# Altium schematic sheet dast.SchDoc
size A3; SPICEModelCacheRLVYLVLF: <root> / <DocumentId>RLVYLVLF</DocumentId> / <CacheFrame Number="0"> / <Model Name="qnpn" Kind="MDL"> / <Text>*QNPN / *NPN Trans Pinout: C,B,E / .MODEL QNPN NPN(IS=3.2E-16 BF=141 VAF=35 ISE=2.6 NE=1.46 CJE=1E-13 / + MJE=0.333 TF=6E-11 CJC=1E-13 CJS=2.2E-13 MJS=0.5 FC=0.67 )</Text> / </Model> / </CacheFrame> / </root>
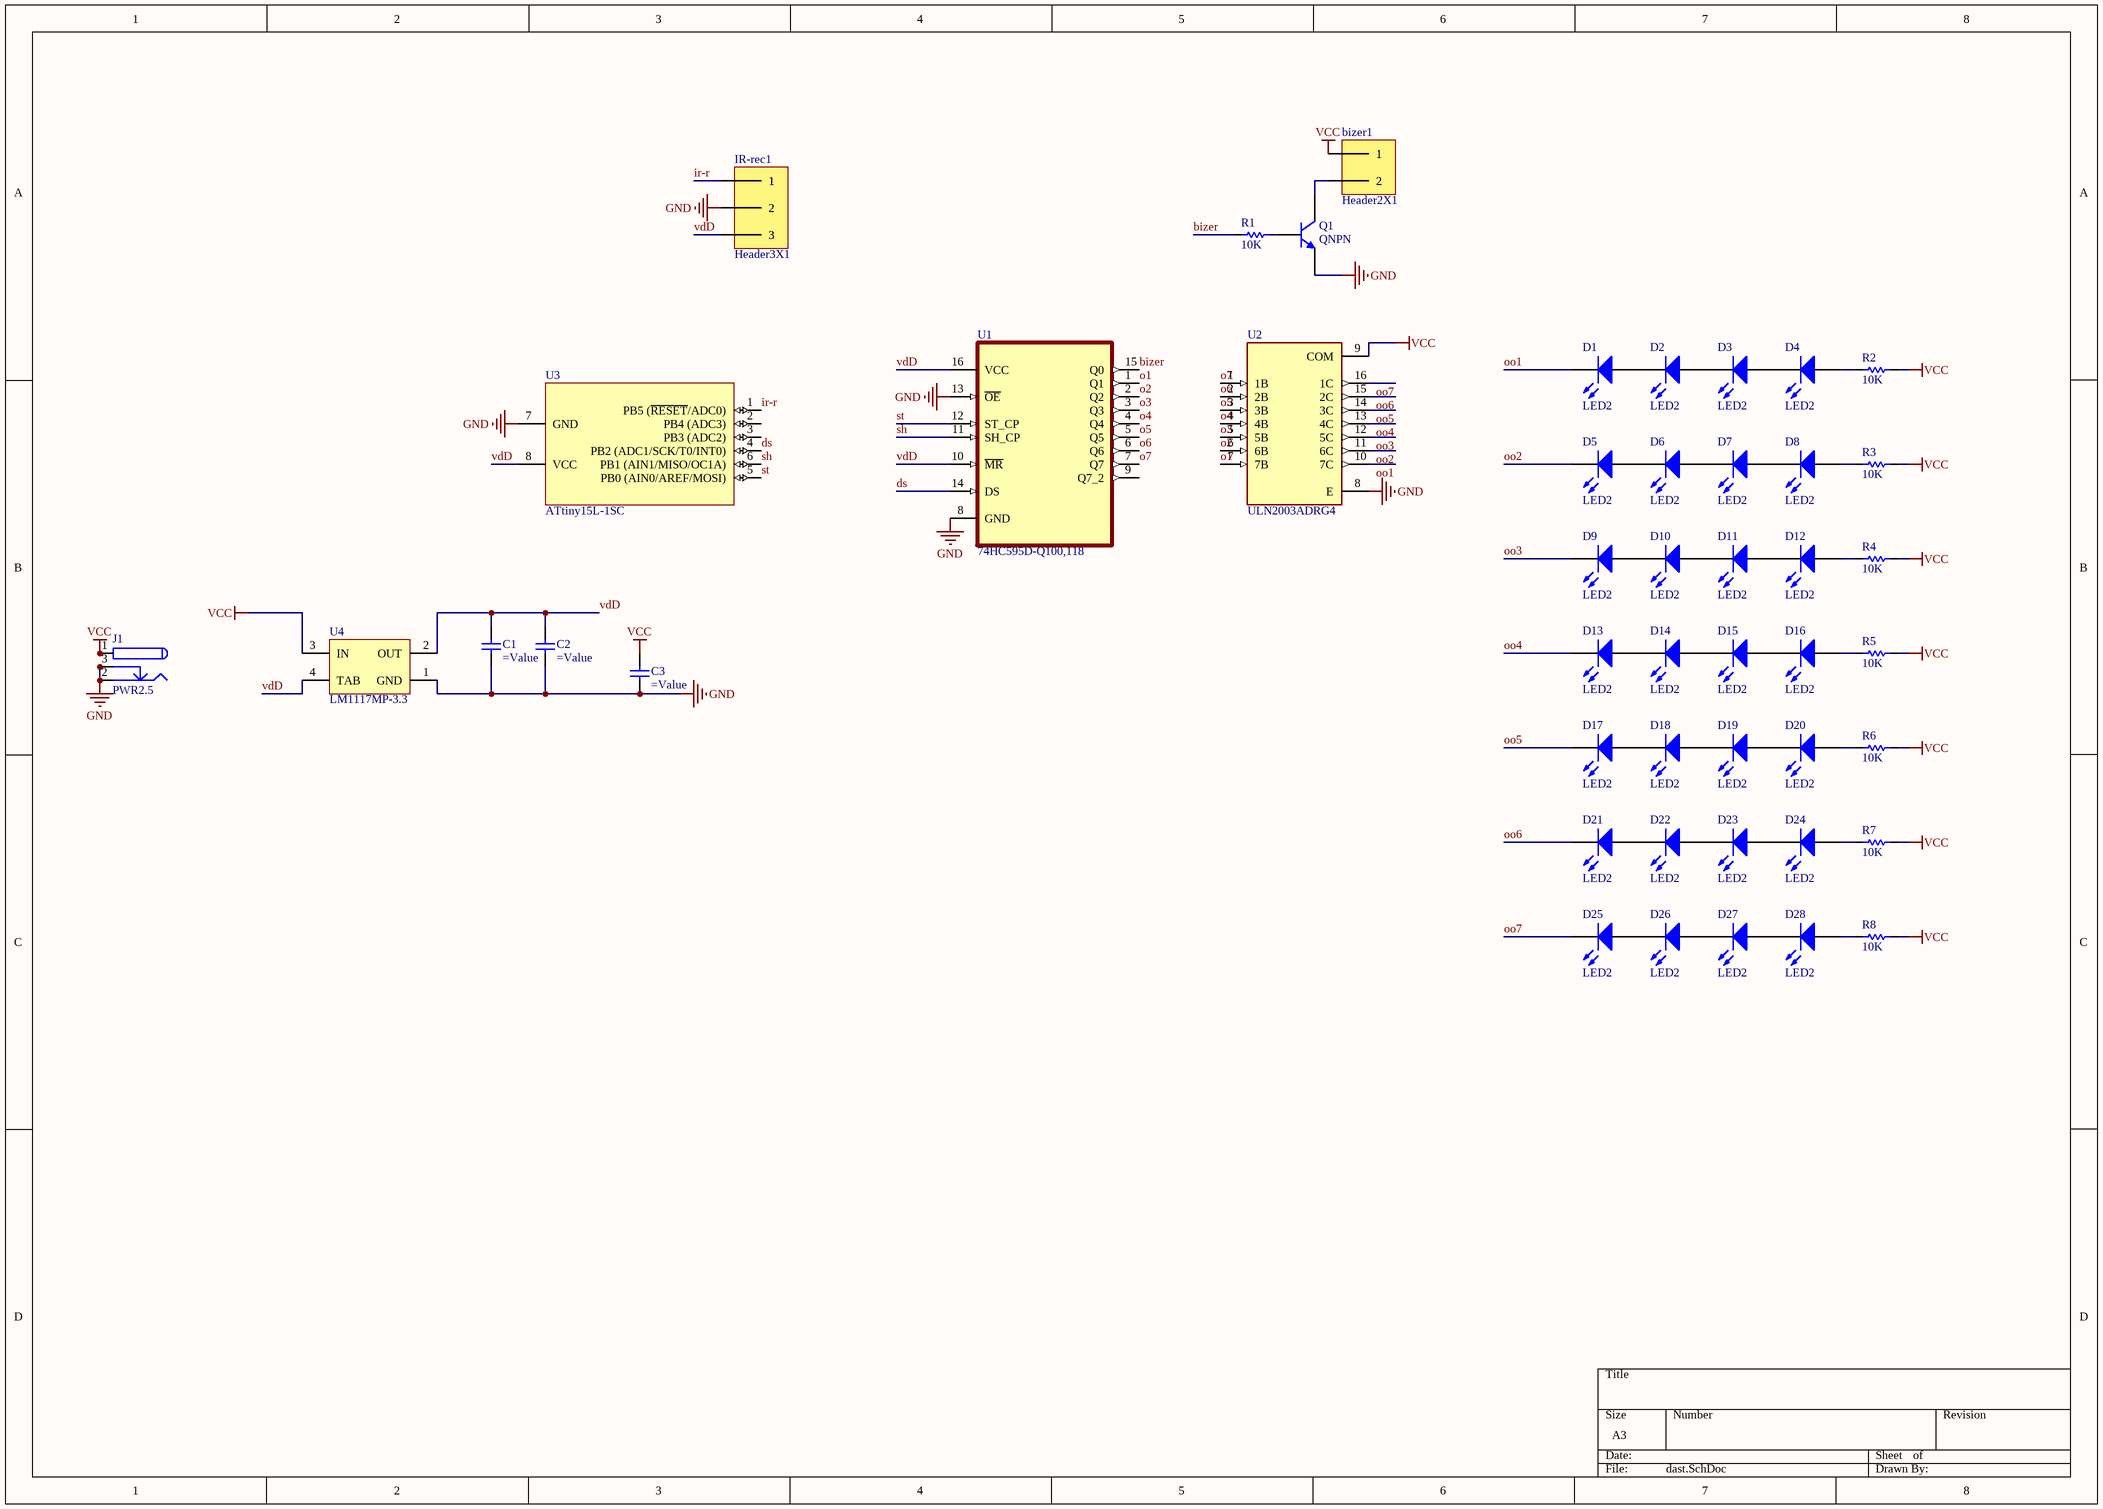
[diagram p0: dast.SchDoc]

## Parts
bizer1  Header2X1  [Header 2X1]
C1  (no value)  [CAP 1206]
C2  (no value)  [CAP 1206]
C3  (no value)  [CAP 1206]
D1  LED2  [3.2X1.6X1.1]
D2  LED2  [3.2X1.6X1.1]
D3  LED2  [3.2X1.6X1.1]
D4  LED2  [3.2X1.6X1.1]
D5  LED2  [3.2X1.6X1.1]
D6  LED2  [3.2X1.6X1.1]
D7  LED2  [3.2X1.6X1.1]
D8  LED2  [3.2X1.6X1.1]
D9  LED2  [3.2X1.6X1.1]
D10  LED2  [3.2X1.6X1.1]
D11  LED2  [3.2X1.6X1.1]
D12  LED2  [3.2X1.6X1.1]
D13  LED2  [3.2X1.6X1.1]
D14  LED2  [3.2X1.6X1.1]
D15  LED2  [3.2X1.6X1.1]
D16  LED2  [3.2X1.6X1.1]
D17  LED2  [3.2X1.6X1.1]
D18  LED2  [3.2X1.6X1.1]
D19  LED2  [3.2X1.6X1.1]
D20  LED2  [3.2X1.6X1.1]
D21  LED2  [3.2X1.6X1.1]
D22  LED2  [3.2X1.6X1.1]
D23  LED2  [3.2X1.6X1.1]
D24  LED2  [3.2X1.6X1.1]
D25  LED2  [3.2X1.6X1.1]
D26  LED2  [3.2X1.6X1.1]
D27  LED2  [3.2X1.6X1.1]
D28  LED2  [3.2X1.6X1.1]
IR-rec1  Header3X1  [HEADER 3X1]
J1  PWR2.5  [KLD-0202]
Q1  QNPN  [SOT-23B_L]
R1  10K  [RES 1206 (3216X08L)]
R2  10K  [RES 1206 (3216X08L)]
R3  10K  [RES 1206 (3216X08L)]
R4  10K  [RES 1206 (3216X08L)]
R5  10K  [RES 1206 (3216X08L)]
R6  10K  [RES 1206 (3216X08L)]
R7  10K  [RES 1206 (3216X08L)]
R8  10K  [RES 1206 (3216X08L)]
U1  74HC595D-Q100,118  [SOIC127P600X175-16N]
U2  ULN2003ADRG4  [SOIC127P600X175-16N]
U3  ATtiny15L-1SC  [8S2_N]
U4  LM1117MP-3.3  [MP04A_N]

## Nets
GND: C1.1(+) C2.1(+) C3.1(+) IR-rec1.2 J1.2 J1.2A J1.2B J1.3 J1.3A J1.3B Q1.3(E) U1.8(GND) U1.13(~{OE}) U2.8(E) U3.7(GND) U4.1(GND)
VCC: bizer1.1 C3.2(-) J1.1 J1.1A J1.1B R2.2 R3.2 R4.2 R5.2 R6.2 R7.2 R8.2 U2.9(COM) U4.3(IN)
bizer: R1.1 U1.15(Q0)
ds: U1.14(DS) U3.4(PB2_(ADC1/SCK/T0/INT0))
ir-r: IR-rec1.1 U3.1(PB5_(~{RESET}/ADC0))
o1: U1.1(Q1) U2.7(7B)
o2: U1.2(Q2) U2.6(6B)
o3: U1.3(Q3) U2.5(5B)
o4: U1.4(Q4) U2.4(4B)
o5: U1.5(Q5) U2.3(3B)
o6: U1.6(Q6) U2.2(2B)
o7: U1.7(Q7) U2.1(1B)
oo1: D1.2(K) U2.10(7C)
oo2: D5.2(K) U2.11(6C)
oo3: D9.2(K) U2.12(5C)
oo4: D13.2(K) U2.13(4C)
oo5: D17.2(K) U2.14(3C)
oo6: D21.2(K) U2.15(2C)
oo7: D25.2(K) U2.16(1C)
sh: U1.11(SH_CP) U3.6(PB1_(AIN1/MISO/OC1A))
st: U1.12(ST_CP) U3.5(PB0_(AIN0/AREF/MOSI))
vdD: C1.2(-) C2.2(-) IR-rec1.3 U1.10(~{MR}) U1.16(VCC) U3.8(VCC) U4.2(OUT) U4.4(TAB)
Netbizer1_2: bizer1.2 Q1.1(C)
NetD1_1: D1.1(A) D2.2(K)
NetD2_1: D2.1(A) D3.2(K)
NetD3_1: D3.1(A) D4.2(K)
NetD4_1: D4.1(A) R2.1
NetD5_1: D5.1(A) D6.2(K)
NetD6_1: D6.1(A) D7.2(K)
NetD7_1: D7.1(A) D8.2(K)
NetD8_1: D8.1(A) R3.1
NetD9_1: D9.1(A) D10.2(K)
NetD10_1: D10.1(A) D11.2(K)
NetD11_1: D11.1(A) D12.2(K)
NetD12_1: D12.1(A) R4.1
NetD13_1: D13.1(A) D14.2(K)
NetD14_1: D14.1(A) D15.2(K)
NetD15_1: D15.1(A) D16.2(K)
NetD16_1: D16.1(A) R5.1
NetD17_1: D17.1(A) D18.2(K)
NetD18_1: D18.1(A) D19.2(K)
NetD19_1: D19.1(A) D20.2(K)
NetD20_1: D20.1(A) R6.1
NetD21_1: D21.1(A) D22.2(K)
NetD22_1: D22.1(A) D23.2(K)
NetD23_1: D23.1(A) D24.2(K)
NetD24_1: D24.1(A) R7.1
NetD25_1: D25.1(A) D26.2(K)
NetD26_1: D26.1(A) D27.2(K)
NetD27_1: D27.1(A) D28.2(K)
NetD28_1: D28.1(A) R8.1
NetQ1_2: Q1.2(B) R1.2

Not connected (* = marked no-connect by the designer): U1 9(Q7_2); U3 2(PB4_(ADC3)) 3(PB3_(ADC2))

## Library data of the parts
C1-C3 = Capacitor
D1-D28 = LED2: Typical RED, GREEN, YELLOW, AMBER GaAs LED; Published: 8-Jun-2000; LatestRevisionDate: 17-Jul-2002; LatestRevisionNote: Re-released for DXP Platform.; PackageVersion: Feb-2002; PackageReference: 3.2X1.6X1.1; Publisher: Altium Limited; PackageDescription: SM LED; 2 Flat Leads
J1 = PWR2.5: Low Voltage Power Supply Connector; Published: 17-Dec-2003; DatasheetDocument: 09-May-2002; Publisher: Altium Limited; ComponentLink1Description: Manufacturer Link; ComponentLink1URL: http://domino.kycon.com/internet/Products.html
Q1 = QNPN: NPN Bipolar Transistor; pin to pad: 1>3 2>1 3>2; Published: 8-Jun-2000; LatestRevisionDate: 29-May-2009; LatestRevisionNote: IPC-7351 Footprint Added.; PackageVersion: Aug-1999; PackageReference: SOT-23B; Publisher: Altium Limited; PackageDescription: 3-Pin SOT-23 Package 0.95 mm Pitch, 2.4 mm Lead Span
R1-R8 = Resistor: Tolerance: 5%; Power: 1/4 W; Value: 10K
U1 = 74HC595D-Q100,118: Shift Shift Register 1 Element 8 Bit 16-SO; MF: Nexperia USA; Check_prices: https://www.snapeda.com/parts/74HC595D-Q100,118/Nexperia/view-part/1041587/?ref=eda; SnapEDA_Link: https://www.snapeda.com/parts/74HC595D-Q100,118/Nexperia/view-part/1041587/?ref=snap; Price: None; MP: 74HC595D-Q100,118; Value: *; Availability: Warning; Package: SO16-16 Nexperia USA Inc.; Purchase-URL: https://pricing.snapeda.com/search/part/74HC595D-Q100,118/?ref=eda
U2 = ULN2003ADRG4: 50-V, 7-ch darlington transistor array, -20C to 70C 16-SOIC -40 to 70; Price: None; MP: ULN2003ADRG4; Availability: Unavailable; Package: None; Value: *
U3 = ATtiny15L-1SC: 8-Bit AVR Microcontroller with 1K Byte of Flash Memory; pin to pad: 1>7 7>8 8>1; Published: 17-Sep-2003; LatestRevisionDate: 16-Oct-2006; LatestRevisionNote: IPC-7351 Footprint Added.; DatasheetVersion: 1187E-AVR-06/02; PackageVersion: revF, Apr-2008; PackageReference: 8S2; Publisher: Altium Limited; PackageDescription: 8-Lead, 0.208" Body, Plastic Small Outline Package (EIAJ); Supplier 1: Digi-Key; Supplier Part Number 1: ATTINY15L-1SC-ND; Supplier 2: Mouser; Supplier Part Number 2: 556-ATTINY15L1SC; ComponentLink1Description: Datasheet; ComponentLink1URL: http://www.atmel.com/dyn/resources/prod_documents/doc1187.pdf; ComponentLink2Description: Atmel.com Home; ComponentLink2URL: http://www.atmel.com
U4 = LM1117MP-3.3: 800mA Low-Dropout Linear Regulator; Manufacturer: National Semiconductor; CompType: LDO IC; PackageTopMarking: XYTT*N05A; PowerWise: N; Published: 4-Dec-2008; DatasheetVersion: Apr-2006; PackageVersion: revB, Apr-2003; PackageReference: MP04A; Publisher: Altium Limited; PackageDescription: Molded SOT-223, 6.50 x 3.56 x 1.6mm Body, 4 Lead, 2.3mm Pitch; PartNumber: LM1117MP-3.3; RoHS: O; PinCount: 4; DigiKeyPartNumber: LM1117MP-3.3CT-ND; Code_JEDEC: TO-261-AA; Code_IPC: SOT223-4; ComponentLink1Description: LM1117 Datasheet; ComponentLink1URL: http://www.national.com/ds/LM/LM1117.pdf; ComponentLink2Description: LM1117 Web Page; ComponentLink2URL: http://www.national.com/pf/LM/LM1117.html; ComponentLink3Description: MP04A Package Page; ComponentLink3URL: http://www.national.com/packaging/folders/mp04a.html